# Altium project ARM_PLUGALL.PrjPCB
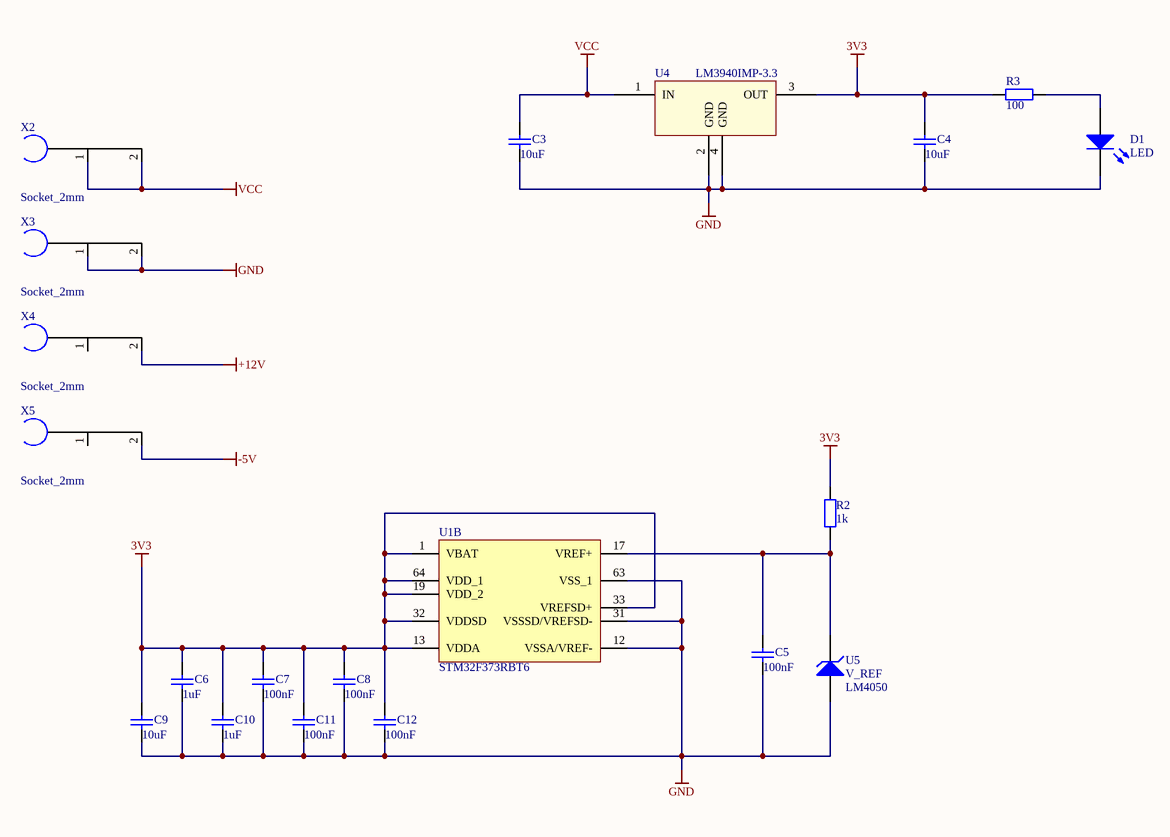
[diagram p0: Power.SchDoc]
3 sheets, 56 parts. Net scope: global (net labels, ports and power ports of the same name join across sheets).
Board file: PCB1.PcbDoc
Sheets:
  Power.SchDoc
  ARM.SchDoc
  LevelConverter.SchDoc

## Sheet Power.SchDoc
size A4; SheetNumber: 1; SheetTotal: 3; PageSetup: Record=PageOptions|CenterHorizontal=True|CenterVertical=True|PrintScale=1.00|XCorrection=1.00|YCorrection=1.00|PrintKind=0|BorderSize=5000000|LeftOffset=0|BottomOffset=0|Orientation=2|PaperLength=1000|PaperWidth=1000|Scale=100|PaperSource=7|PrintQuality=-3|MediaType=1|DitherType=10|PrintScaleMode=1|PaperKind=A4|PaperIndex=9

### Parts
(Parts that share a designator on the sheet are numbered #1, #2 ... from top to bottom, then left to right.)
C3  value 10uF  [0805]  (hidden comment: C)
C4  value 10uF  [0805]  (hidden comment: C)
C5  value 100nF  [0805]  (hidden comment: C)
C6  value 1uF  [0805]  (hidden comment: C)
C7  value 100nF  [0805]  (hidden comment: C)
C8  value 100nF  [0805]  (hidden comment: C)
C9  value 10uF  [0805]  (hidden comment: C)
C10  value 1uF  [0805]  (hidden comment: C)
C11  value 100nF  [0805]  (hidden comment: C)
C12  value 100nF  [0805]  (hidden comment: C)
D1  LED  [D_0603]
R2  value 1k  [R_0603]  (hidden comment: R)
R3  value 100  [R_0603]  (hidden comment: R)
U1#1  STM32F373RBT6  [STM-LQFP64_V]  (part B of 2)
U4  LM3940IMP-3.3  [SOT-223]
U5  V_REF  value LM4050  [SOT-23]
X2  Socket_2mm  [2MM_BANANA]
X3  Socket_2mm  [2MM_BANANA]
X4  Socket_2mm  [2MM_BANANA]
X5  Socket_2mm  [2MM_BANANA]

### Nets
3V3: C4.2 C6.2 C7.2 C8.1 C9.2 C10.2 C11.2 C12.2 R2.2 R3.1 U1#1.1(VBAT) U1#1.13(VDDA) U1#1.19(VDD_2) U1#1.32(VDDSD) U1#1.33(VREFSD+) U1#1.64(VDD_1) U4.3(OUT)
+12V: X4.2
-5V: X5.2
GND: C3.1 C4.1 C5.1 C6.1 C7.1 C8.2 C9.1 C10.1 C11.1 C12.1 D1.2(K) U1#1.12(VSSA/VREF-) U1#1.31(VSSSD/VREFSD-) U1#1.63(VSS_1) U4.2(GND) U4.4(GND) U5.2(A) X3.1 X3.2
VCC: C3.2 U4.1(IN) X2.1 X2.2
NetC5_2: C5.2 R2.1 U1#1.17(VREF+) U5.1(K)
NetD1_1: D1.1(A) R3.2

Not connected (* = marked no-connect by the designer): X4 1; X5 1

### Library data of the parts
D1 = LED: Value: BLU
R2 R3 = RES_EU
U1#1 = CMP-0572-00032-2: ARM Cortex-M4 32-bit MCU, 128 KB Flash, 24 KB Internal RAM, 52 I/Os, 64-pin LQFP, -40 to 85 degC, Tray; FLASH Size (Prog) (kB): 128; Operating Frequency(F) (Processor speed) (MHz): 72; Supply Voltage(Vcc) min (V): 2; Internal RAM Size (kB): 24; I/Os (High Current): 52; PackageVersion: Rev. 4, 06/2013; Core: ARM Cortex-M4; Packing: Tray; ComponentLink2URL: http://www.st.com/st-web-ui/static/active/en/resource/technical/document/datasheet/DM00046749.pdf; PackageReference: LQFP64; PartNumber: STM32F373RBT6; ComponentLink1URL: http://www.st.com/web/en/home.html; ComponentLink1Description: Manufacturer URL; PackageDescription: 64-Pin Low Profile Quad Flat Package, 10 x 10 mm Body, 0.5 mm Pitch; DatasheetVersion: Rev. 3; ComponentLink3Description: Package Specification; ComponentLink2Description: Datasheet; Mounting Technology: Surface Mount; ComponentLink3URL: http://www.st.com/st-web-ui/static/active/en/resource/technical/document/datasheet/DM00037051.pdf
X2 X4 = Socket_2mm: Value: Banana_2mm_RED
X3 X5 = Socket_2mm: Value: Banana_2mm_BLK
U4 = LM3940IMP-3.3: Value: LM3940IMP-3.3

## Sheet ARM.SchDoc
size A4; Date: 14.07.2014; DrawnBy: Noah Huetter; SheetNumber: 3; SheetTotal: 3; PageSetup: Record=PageOptions|CenterHorizontal=True|CenterVertical=True|PrintScale=1.00|XCorrection=1.00|YCorrection=1.00|PrintKind=0|BorderSize=5000000|LeftOffset=0|BottomOffset=0|Orientation=2|PaperLength=1000|PaperWidth=1000|Scale=100|PaperSource=7|PrintQuality=-3|MediaType=1|DitherType=10|PrintScaleMode=1|PaperKind=A4|PaperIndex=9; DocumentName: STM32F3 PLUGALL
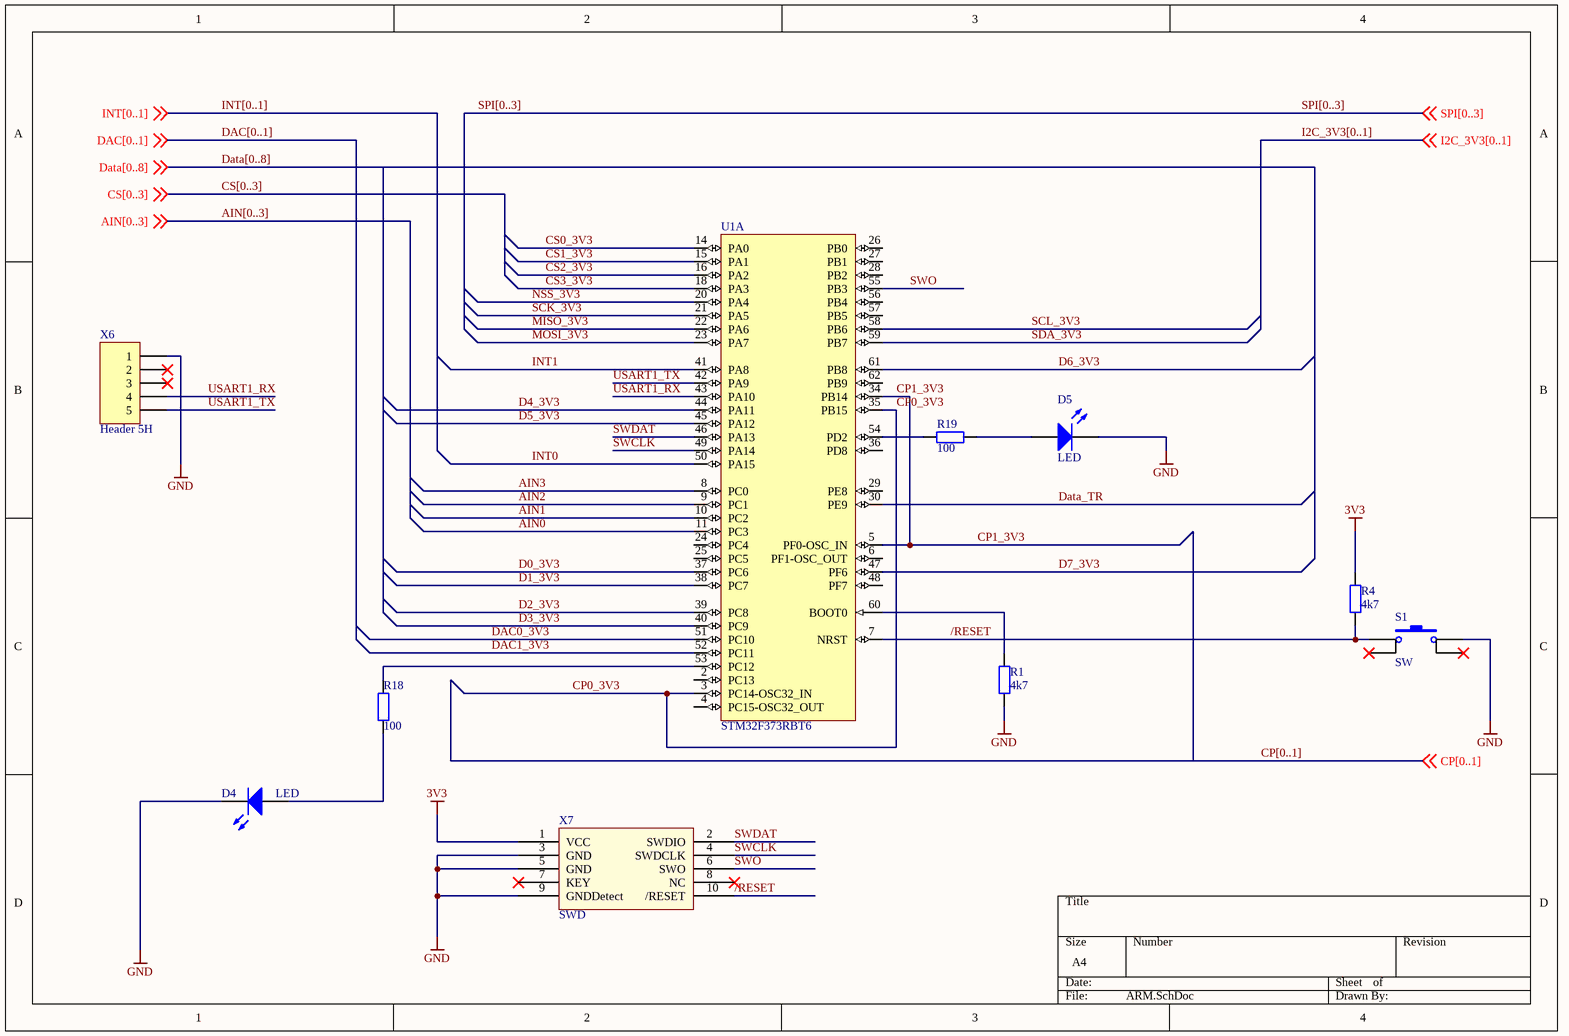
[diagram p1: ARM.SchDoc]

### Parts
(Parts that share a designator on the sheet are numbered #1, #2 ... from top to bottom, then left to right.)
D4  LED  [D_0603]
D5  LED  [D_0603]
R1  value 4k7  [R_0603]  (hidden comment: R)
R4  value 4k7  [R_0603]  (hidden comment: R)
R18  value 100  [R_0603]  (hidden comment: R)
R19  value 100  [R_0603]  (hidden comment: R)
S1  SW  [SW_4x4x1.5]
U1#2  STM32F373RBT6  [STM-LQFP64_V]  (part A of 2)
X6  Header 5H  [HDR1X5H]
X7  SWD  [4448.0054]

### Nets
3V3: R4.2 X7.1(VCC)
GND: D4.2(K) D5.2(K) R1.1 S1.2 X6.1 X7.3(GND) X7.5(GND) X7.9(GNDDetect)
/RESET: R4.1 S1.1 U1#2.7(NRST) X7.10(/RESET)
AIN0: U1#2.11(PC3)
AIN1: U1#2.10(PC2)
AIN2: U1#2.9(PC1)
AIN3: U1#2.8(PC0)
CP0_3V3: U1#2.3(PC14-OSC32_IN) U1#2.35(PB15)
CP1_3V3: U1#2.5(PF0-OSC_IN) U1#2.34(PB14)
CS0_3V3: U1#2.14(PA0)
CS1_3V3: U1#2.15(PA1)
CS2_3V3: U1#2.16(PA2)
CS3_3V3: U1#2.18(PA3)
D0_3V3: U1#2.37(PC6)
D1_3V3: U1#2.38(PC7)
D2_3V3: U1#2.39(PC8)
D3_3V3: U1#2.40(PC9)
D4_3V3: U1#2.44(PA11)
D5_3V3: U1#2.45(PA12)
D6_3V3: U1#2.61(PB8)
D7_3V3: U1#2.47(PF6)
DAC0_3V3: U1#2.51(PC10)
DAC1_3V3: U1#2.52(PC11)
Data_TR: U1#2.30(PE9)
INT0: U1#2.50(PA15)
INT1: U1#2.41(PA8)
MISO_3V3: U1#2.22(PA6)
MOSI_3V3: U1#2.23(PA7)
NSS_3V3: U1#2.20(PA4)
SCK_3V3: U1#2.21(PA5)
SCL_3V3: U1#2.58(PB6)
SDA_3V3: U1#2.59(PB7)
SWCLK: U1#2.49(PA14) X7.4(SWDCLK)
SWDAT: U1#2.46(PA13) X7.2(SWDIO)
SWO: U1#2.55(PB3) X7.6(SWO)
USART1_RX: U1#2.43(PA10) X6.4
USART1_TX: U1#2.42(PA9) X6.5
NetD4_1: D4.1(A) R18.1
NetD5_1: D5.1(A) R19.1
NetR1_2: R1.2 U1#2.60(BOOT0)
NetR18_2: R18.2 U1#2.53(PC12)
NetR19_2: R19.2 U1#2.54(PD2)

Not connected (* = marked no-connect by the designer): S1 3* 4*; U1#2 2(PC13) 4(PC15-OSC32_OUT) 6(PF1-OSC_OUT) 24(PC4) 25(PC5) 26(PB0) 27(PB1) 28(PB2) 29(PE8) 36(PD8) 48(PF7) 56(PB4) 57(PB5) 62(PB9); X6 2* 3*; X7 7(KEY)* 8(NC)*

### Buses and harness runs
bus AIN[0..3]
bus CP[0..1]
bus CS[0..3]
bus DAC[0..1]
bus Data[0..8]
bus I2C_3V3[0..1]
bus INT[0..1]
bus SPI[0..3]

### Library data of the parts
D4 = LED: Value: GRN
D5 = LED: Value: RED
R1 R4 R18 R19 = RES_EU
U1#2 = CMP-0572-00032-2: ARM Cortex-M4 32-bit MCU, 128 KB Flash, 24 KB Internal RAM, 52 I/Os, 64-pin LQFP, -40 to 85 degC, Tray; FLASH Size (Prog) (kB): 128; Operating Frequency(F) (Processor speed) (MHz): 72; Supply Voltage(Vcc) min (V): 2; Internal RAM Size (kB): 24; I/Os (High Current): 52; Value: STM32F372RBT6; PackageVersion: Rev. 4, 06/2013; Core: ARM Cortex-M4; Packing: Tray; ComponentLink2URL: http://www.st.com/st-web-ui/static/active/en/resource/technical/document/datasheet/DM00046749.pdf; PackageReference: LQFP64; PartNumber: STM32F373RBT6; ComponentLink1URL: http://www.st.com/web/en/home.html; ComponentLink1Description: Manufacturer URL; PackageDescription: 64-Pin Low Profile Quad Flat Package, 10 x 10 mm Body, 0.5 mm Pitch; DatasheetVersion: Rev. 3; ComponentLink3Description: Package Specification; ComponentLink2Description: Datasheet; Mounting Technology: Surface Mount; ComponentLink3URL: http://www.st.com/st-web-ui/static/active/en/resource/technical/document/datasheet/DM00037051.pdf
X6 = Header 5H: Header, 5-Pin, Right Angle; Value: 1X5; LatestRevisionDate: 17-Jul-2002; LatestRevisionNote: Re-released for DXP Platform.; Publisher: Altium Limited
X7 = SWD: Value: 2X5
S1 = SW: Value: SW

## Sheet LevelConverter.SchDoc
size A4; SheetNumber: 2; SheetTotal: 3; PageSetup: Record=PageOptions|CenterHorizontal=True|CenterVertical=True|PrintScale=1.00|XCorrection=1.00|YCorrection=1.00|PrintKind=0|BorderSize=5000000|LeftOffset=0|BottomOffset=0|Orientation=2|PaperLength=1000|PaperWidth=1000|Scale=100|PaperSource=7|PrintQuality=-3|MediaType=1|DitherType=10|PrintScaleMode=1|PaperKind=A4|PaperIndex=9
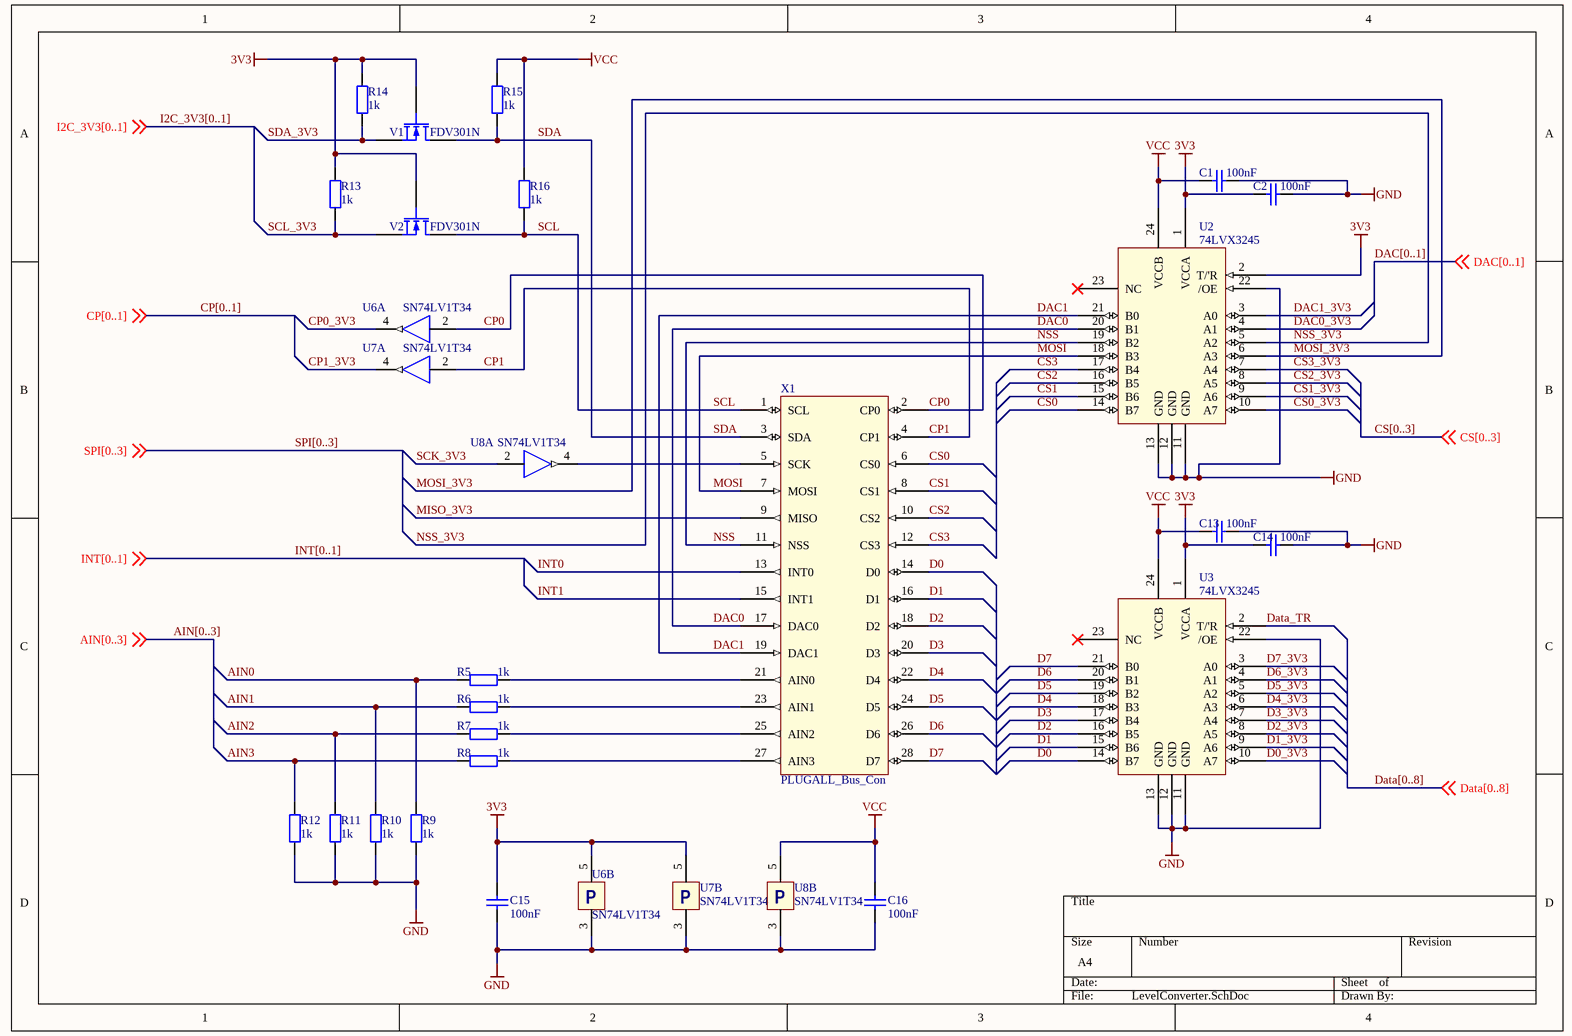
[diagram p2: LevelConverter.SchDoc]

### Parts
C1  value 100nF  [0805]  (hidden comment: C)
C2  value 100nF  [0805]  (hidden comment: C)
C13  value 100nF  [0805]  (hidden comment: C)
C14  value 100nF  [0805]  (hidden comment: C)
C15  value 100nF  [0805]  (hidden comment: C)
C16  value 100nF  [0805]  (hidden comment: C)
R5  value 1k  [R_0603]  (hidden comment: R)
R6  value 1k  [R_0603]  (hidden comment: R)
R7  value 1k  [R_0603]  (hidden comment: R)
R8  value 1k  [R_0603]  (hidden comment: R)
R9  value 1k  [R_0603]  (hidden comment: R)
R10  value 1k  [R_0603]  (hidden comment: R)
R11  value 1k  [R_0603]  (hidden comment: R)
R12  value 1k  [R_0603]  (hidden comment: R)
R13  value 1k  [R_0603]  (hidden comment: R)
R14  value 1k  [R_0603]  (hidden comment: R)
R15  value 1k  [R_0603]  (hidden comment: R)
R16  value 1k  [R_0603]  (hidden comment: R)
U2  74LVX3245  [TSSOP24]
U3  74LVX3245  [TSSOP24]
U6  SN74LV1T34  [DCK]  (parts A,B of 2)
U7  SN74LV1T34  [DCK]  (parts A,B of 2)
U8  SN74LV1T34  [DCK]  (parts A,B of 2)
V1  FDV301N  [SOT-23]
V2  FDV301N  [SOT-23]
X1  PLUGALL_Bus_Con  [CON14X2]

### Nets
3V3: C2.1 C14.1 C15.2 R13.2 R14.2 U2.1(VCCA) U2.2(T/'R) U3.1(VCCA) U6.5(VCC) U7.5(VCC) V1.2(G) V2.2(G)
GND: C1.2 C2.2 C13.2 C14.2 C15.1 C16.1 R9.1 R10.1 R11.1 R12.1 U2.11(GND) U2.12(GND) U2.13(GND) U2.22(/OE) U3.11(GND) U3.12(GND) U3.13(GND) U3.22(/OE) U6.3(GND) U7.3(GND) U8.3(GND)
VCC: C1.1 C13.1 C16.2 R15.2 R16.2 U2.24(VCCB) U3.24(VCCB) U8.5(VCC)
AIN0: R5.1 R9.2
AIN1: R6.1 R10.2
AIN2: R7.1 R11.2
AIN3: R8.1 R12.2
CP0: U6.2(IN) X1.2(CP0)
CP0_3V3: U6.4(OUT)
CP1: U7.2(IN) X1.4(CP1)
CP1_3V3: U7.4(OUT)
CS0: U2.14(B7) X1.6(CS0)
CS0_3V3: U2.10(A7)
CS1: U2.15(B6) X1.8(CS1)
CS1_3V3: U2.9(A6)
CS2: U2.16(B5) X1.10(CS2)
CS2_3V3: U2.8(A5)
CS3: U2.17(B4) X1.12(CS3)
CS3_3V3: U2.7(A4)
D0: U3.14(B7) X1.14(D0)
D0_3V3: U3.10(A7)
D1: U3.15(B6) X1.16(D1)
D1_3V3: U3.9(A6)
D2: U3.16(B5) X1.18(D2)
D2_3V3: U3.8(A5)
D3: U3.17(B4) X1.20(D3)
D3_3V3: U3.7(A4)
D4: U3.18(B3) X1.22(D4)
D4_3V3: U3.6(A3)
D5: U3.19(B2) X1.24(D5)
D5_3V3: U3.5(A2)
D6: U3.20(B1) X1.26(D6)
D6_3V3: U3.4(A1)
D7: U3.21(B0) X1.28(D7)
D7_3V3: U3.3(A0)
DAC0: U2.20(B1) X1.17(DAC0)
DAC0_3V3: U2.4(A1)
DAC1: U2.21(B0) X1.19(DAC1)
DAC1_3V3: U2.3(A0)
Data_TR: U3.2(T/'R)
INT0: X1.13(INT0)
INT1: X1.15(INT1)
MISO_3V3: X1.9(MISO)
MOSI: U2.18(B3) X1.7(MOSI)
MOSI_3V3: U2.6(A3)
NSS: U2.19(B2) X1.11(NSS)
NSS_3V3: U2.5(A2)
SCK_3V3: U8.2(IN)
SCL: R16.1 V2.1(D) X1.1(SCL)
SCL_3V3: R13.1 V2.3(S)
SDA: R15.1 V1.1(D) X1.3(SDA)
SDA_3V3: R14.1 V1.3(S)
NetR5_2: R5.2 X1.21(AIN0)
NetR6_2: R6.2 X1.23(AIN1)
NetR7_2: R7.2 X1.25(AIN2)
NetR8_2: R8.2 X1.27(AIN3)
NetU8_4: U8.4(OUT) X1.5(SCK)

Not connected (* = marked no-connect by the designer): U2 23(NC)*; U3 23(NC)*

### Buses and harness runs
bus AIN[0..3]
bus CP[0..1]
bus CS[0..3]
bus DAC[0..1]
bus Data[0..8]
bus I2C_3V3[0..1]
bus INT[0..1]
bus SPI[0..3]

### Notes on the sheet
- (in symbol SN74LV1T34, part B) P

### Library data of the parts
R5-R16 = RES_EU
V1 V2 = MOSFET-N: pin to pad: 1>3 2>1 3>2; Value: FDV301N
X1 = PLUGALL_Bus_Con: PLUGALL Card Connector; Value: 2x14
U2 U3 = 74LVX3245: Value: 74LVX3245
U6-U8 = SN74LV1T34: Value: SN74LV1T34

## Nets that join several sheets
3V3: Power (17 pins), ARM (R4.2 X7.1), LevelConverter (12 pins)
GND: Power (19 pins), ARM (8 pins), LevelConverter (21 pins)
VCC: Power (C3.2 U4.1 X2.1 X2.2), LevelConverter (8 pins)
AIN0: ARM (U1#2.11), LevelConverter (R5.1 R9.2)
AIN1: ARM (U1#2.10), LevelConverter (R6.1 R10.2)
AIN2: ARM (U1#2.9), LevelConverter (R7.1 R11.2)
AIN3: ARM (U1#2.8), LevelConverter (R8.1 R12.2)
CP0_3V3: ARM (U1#2.3 U1#2.35), LevelConverter (U6.4)
CP1_3V3: ARM (U1#2.5 U1#2.34), LevelConverter (U7.4)
CS0_3V3: ARM (U1#2.14), LevelConverter (U2.10)
CS1_3V3: ARM (U1#2.15), LevelConverter (U2.9)
CS2_3V3: ARM (U1#2.16), LevelConverter (U2.8)
CS3_3V3: ARM (U1#2.18), LevelConverter (U2.7)
D0_3V3: ARM (U1#2.37), LevelConverter (U3.10)
D1_3V3: ARM (U1#2.38), LevelConverter (U3.9)
D2_3V3: ARM (U1#2.39), LevelConverter (U3.8)
D3_3V3: ARM (U1#2.40), LevelConverter (U3.7)
D4_3V3: ARM (U1#2.44), LevelConverter (U3.6)
D5_3V3: ARM (U1#2.45), LevelConverter (U3.5)
D6_3V3: ARM (U1#2.61), LevelConverter (U3.4)
D7_3V3: ARM (U1#2.47), LevelConverter (U3.3)
DAC0_3V3: ARM (U1#2.51), LevelConverter (U2.4)
DAC1_3V3: ARM (U1#2.52), LevelConverter (U2.3)
Data_TR: ARM (U1#2.30), LevelConverter (U3.2)
INT0: ARM (U1#2.50), LevelConverter (X1.13)
INT1: ARM (U1#2.41), LevelConverter (X1.15)
MISO_3V3: ARM (U1#2.22), LevelConverter (X1.9)
MOSI_3V3: ARM (U1#2.23), LevelConverter (U2.6)
NSS_3V3: ARM (U1#2.20), LevelConverter (U2.5)
SCK_3V3: ARM (U1#2.21), LevelConverter (U8.2)
SCL_3V3: ARM (U1#2.58), LevelConverter (R13.1 V2.3)
SDA_3V3: ARM (U1#2.59), LevelConverter (R14.1 V1.3)